# EAGLE schematic Preamp (EAGLE 8.2.2)
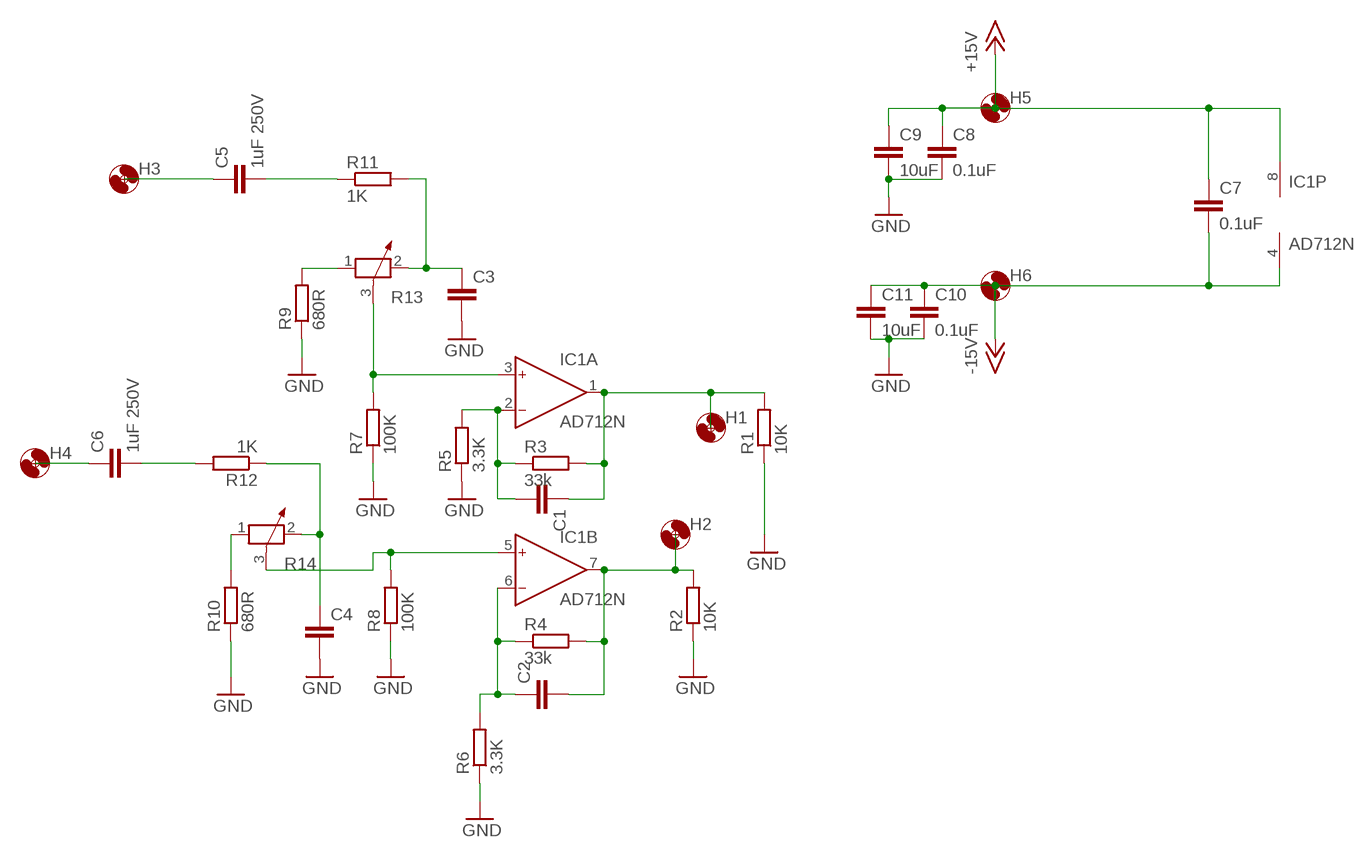
[diagram p0: schematic, sheet 1]

## Parts
C1  C-EUC0805K  [C0805K]
C2  C-EUC0805K  [C0805K]
C3  C-EUC0805K  [C0805K]
C4  C-EUC0805K  [C0805K]
C5  1uF 250V  C-EUC0805K  [C0805K]
C6  1uF 250V  C-EUC0805K  [C0805K]
C7  0.1uF  C-EUC0805K  [C0805K]
C8  0.1uF  C-EUC0805K  [C0805K]
C9  10uF  C-EUC0805K  [C0805K]
C10  0.1uF  C-EUC0805K  [C0805K]
C11  10uF  C-EUC0805K  [C0805K]
H1  MOUNT-HOLE3.0  [3,0]
H2  MOUNT-HOLE3.0  [3,0]
H3  MOUNT-HOLE3.0  [3,0]
H4  MOUNT-HOLE3.0  [3,0]
H5  MOUNT-HOLE3.0  [3,0]
H6  MOUNT-HOLE3.0  [3,0]
IC1  AD712N  [DIL08]
R1  10K  R-EU_R0805W  [R0805W]
R2  10K  R-EU_R0805W  [R0805W]
R3  33k  R-EU_R0805W  [R0805W]
R4  33k  R-EU_R0805W  [R0805W]
R5  3.3K  R-EU_R0805W  [R0805W]
R6  3.3K  R-EU_R0805W  [R0805W]
R7  100K  R-EU_R0805W  [R0805W]
R8  100K  R-EU_R0805W  [R0805W]
R9  680R  R-EU_R0805W  [R0805W]
R10  680R  R-EU_R0805W  [R0805W]
R11  1K  R-EU_R0805W  [R0805W]
R12  1K  R-EU_R0805W  [R0805W]
R13  POTENTIOMETER_PT-10S  [PT-10S]
R14  POTENTIOMETER_PT-10S  [PT-10S]

## Nets
+15V: C7.1 C8.1 C9.1 H5.P$1 IC1.8(P:V+)
-15V: C7.2 C10.1 C11.1 H6.P$1 IC1.4(P:V-)
GND: C3.2 C4.2 C8.2 C9.2 C10.2 C11.2 R1.1 R2.1 R5.1 R6.1 R7.1 R8.1 R9.1 R10.1
N$1: C1.1 H1.P$1 IC1.1(A:OUT) R1.2 R3.2
N$2: C2.2 H2.P$1 IC1.7(B:OUT) R2.2 R4.2
N$3: C1.2 IC1.2(A:IN-) R3.1 R5.2
N$4: C2.1 IC1.6(B:IN-) R4.1 R6.2
N$5: IC1.3(A:IN+) R7.2 R13.3
N$6: IC1.5(B:IN+) R8.2 R14.3
N$7: C6.2 R12.2
N$8: R10.2 R14.1
N$9: R9.2 R13.1
N$10: C3.1 R11.2 R13.2
N$11: C4.1 R12.1 R14.2
N$12: C5.2 R11.1
N$13: C5.1 H3.P$1
N$14: C6.1 H4.P$1

## Library data of the parts
C1-C11 = rcl:C-EU: CAPACITOR, European symbol
H1-H6 = holes:MOUNT-HOLE: MOUNTING HOLE with drill center marker
IC1 = analog-devices:AD712: Dual Precision, Low Cost, High Speed BiFET Op Amp Source: http://www.analog.com/static/imported-files/data_sheets/AD712.pdf; MF: ALTERA CORPORATION; MPN: AD712JNZ; OC_FARNELL: 9604898; OC_NEWARK: 59K4554
R1-R12 = rcl:R-EU_: RESISTOR, European symbol
R13 R14 = rcl:POTENTIOMETER_: Potentiometer